# EAGLE schematic IR Sensor Schematic v17 (EAGLE 9.7.0)
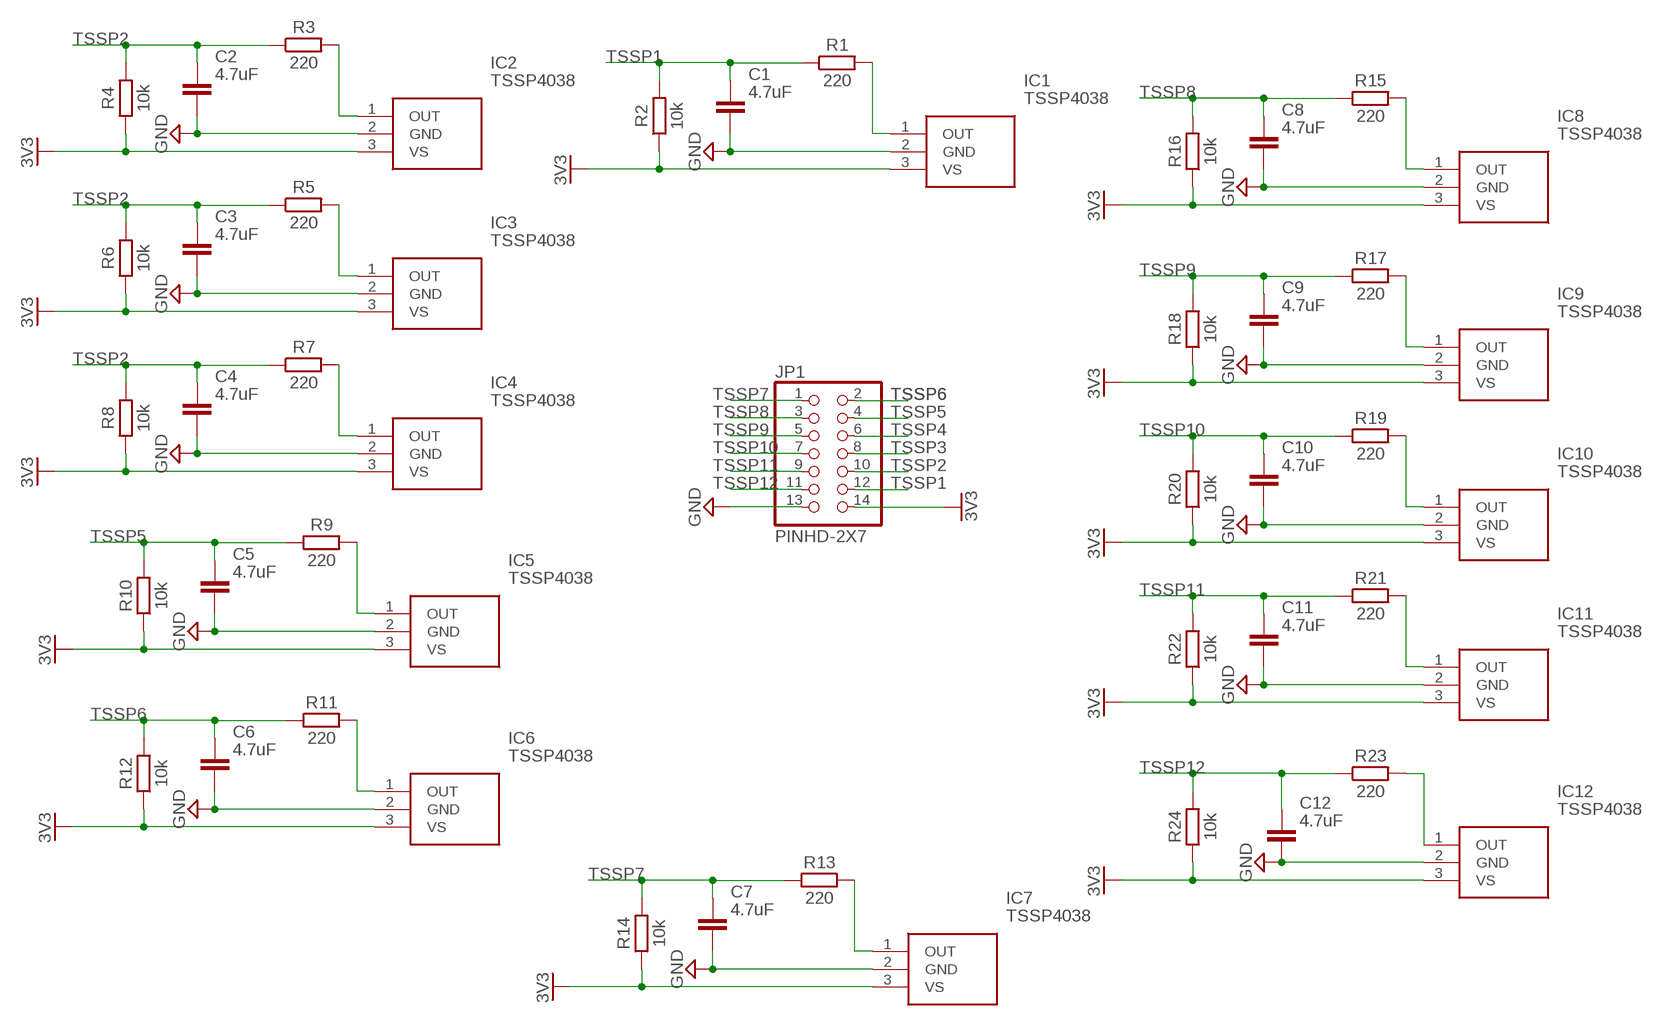
[diagram p0: schematic, sheet 1]

## Parts
C1  4.7uF  C_CHIP-1206(3216-METRIC)  [CAPC3216X135]
C2  4.7uF  C_CHIP-1206(3216-METRIC)  [CAPC3216X135]
C3  4.7uF  C_CHIP-1206(3216-METRIC)  [CAPC3216X135]
C4  4.7uF  C_CHIP-1206(3216-METRIC)  [CAPC3216X135]
C5  4.7uF  C_CHIP-1206(3216-METRIC)  [CAPC3216X135]
C6  4.7uF  C_CHIP-1206(3216-METRIC)  [CAPC3216X135]
C7  4.7uF  C_CHIP-1206(3216-METRIC)  [CAPC3216X135]
C8  4.7uF  C_CHIP-1206(3216-METRIC)  [CAPC3216X135]
C9  4.7uF  C_CHIP-1206(3216-METRIC)  [CAPC3216X135]
C10  4.7uF  C_CHIP-1206(3216-METRIC)  [CAPC3216X135]
C11  4.7uF  C_CHIP-1206(3216-METRIC)  [CAPC3216X135]
C12  4.7uF  C_CHIP-1206(3216-METRIC)  [CAPC3216X135]
IC1  TSSP4038  [TSSP4038]
IC2  TSSP4038  [TSSP4038]
IC3  TSSP4038  [TSSP4038]
IC4  TSSP4038  [TSSP4038]
IC5  TSSP4038  [TSSP4038]
IC6  TSSP4038  [TSSP4038]
IC7  TSSP4038  [TSSP4038]
IC8  TSSP4038  [TSSP4038]
IC9  TSSP4038  [TSSP4038]
IC10  TSSP4038  [TSSP4038]
IC11  TSSP4038  [TSSP4038]
IC12  TSSP4038  [TSSP4038]
JP1  PINHD-2X7  [2X07]
R1  220  R_CHIP-1206(3216-METRIC)  [RESC3216X70]
R2  10k  R_CHIP-1206(3216-METRIC)  [RESC3216X70]
R3  220  R_CHIP-1206(3216-METRIC)  [RESC3216X70]
R4  10k  R_CHIP-1206(3216-METRIC)  [RESC3216X70]
R5  220  R_CHIP-1206(3216-METRIC)  [RESC3216X70]
R6  10k  R_CHIP-1206(3216-METRIC)  [RESC3216X70]
R7  220  R_CHIP-1206(3216-METRIC)  [RESC3216X70]
R8  10k  R_CHIP-1206(3216-METRIC)  [RESC3216X70]
R9  220  R_CHIP-1206(3216-METRIC)  [RESC3216X70]
R10  10k  R_CHIP-1206(3216-METRIC)  [RESC3216X70]
R11  220  R_CHIP-1206(3216-METRIC)  [RESC3216X70]
R12  10k  R_CHIP-1206(3216-METRIC)  [RESC3216X70]
R13  220  R_CHIP-1206(3216-METRIC)  [RESC3216X70]
R14  10k  R_CHIP-1206(3216-METRIC)  [RESC3216X70]
R15  220  R_CHIP-1206(3216-METRIC)  [RESC3216X70]
R16  10k  R_CHIP-1206(3216-METRIC)  [RESC3216X70]
R17  220  R_CHIP-1206(3216-METRIC)  [RESC3216X70]
R18  10k  R_CHIP-1206(3216-METRIC)  [RESC3216X70]
R19  220  R_CHIP-1206(3216-METRIC)  [RESC3216X70]
R20  10k  R_CHIP-1206(3216-METRIC)  [RESC3216X70]
R21  220  R_CHIP-1206(3216-METRIC)  [RESC3216X70]
R22  10k  R_CHIP-1206(3216-METRIC)  [RESC3216X70]
R23  220  R_CHIP-1206(3216-METRIC)  [RESC3216X70]
R24  10k  R_CHIP-1206(3216-METRIC)  [RESC3216X70]

## Nets
3V3: IC1.3(VS) IC2.3(VS) IC3.3(VS) IC4.3(VS) IC5.3(VS) IC6.3(VS) IC7.3(VS) IC8.3(VS) IC9.3(VS) IC10.3(VS) IC11.3(VS) IC12.3(VS) JP1.14 R2.1 R4.1 R6.1 R8.1 R10.1 R12.1 R14.1 R16.1 R18.1 R20.1 R22.1 R24.1
GND: C1.2 C2.2 C3.2 C4.2 C5.2 C6.2 C7.2 C8.2 C9.2 C10.2 C11.2 C12.2 IC1.2(GND) IC2.2(GND) IC3.2(GND) IC4.2(GND) IC5.2(GND) IC6.2(GND) IC7.2(GND) IC8.2(GND) IC9.2(GND) IC10.2(GND) IC11.2(GND) IC12.2(GND) JP1.13
N$1: IC12.1(OUT) R23.2
N$2: IC1.1(OUT) R1.2
N$3: IC2.1(OUT) R3.2
N$5: IC3.1(OUT) R5.2
N$7: IC4.1(OUT) R7.2
N$9: IC5.1(OUT) R9.2
N$11: IC6.1(OUT) R11.2
N$13: IC7.1(OUT) R13.2
N$15: IC8.1(OUT) R15.2
N$17: IC9.1(OUT) R17.2
N$19: IC10.1(OUT) R19.2
N$21: IC11.1(OUT) R21.2
TSSP1: C1.1 JP1.12 R1.1 R2.2
TSSP2: C2.1 C3.1 C4.1 JP1.10 R3.1 R4.2 R5.1 R6.2 R7.1 R8.2
TSSP3: JP1.8
TSSP4: JP1.6
TSSP5: C5.1 JP1.4 R9.1 R10.2
TSSP6: C6.1 JP1.2 R11.1 R12.2
TSSP7: C7.1 JP1.1 R13.1 R14.2
TSSP8: C8.1 JP1.3 R15.1 R16.2
TSSP9: C9.1 JP1.5 R17.1 R18.2
TSSP10: C10.1 JP1.7 R19.1 R20.2
TSSP11: C11.1 JP1.9 R21.1 R22.2
TSSP12: C12.1 JP1.11 R23.1 R24.2

## Library data of the parts
C1-C12 = Tutorial - Fusion 360:C: Capacitor - Generic; CATEGORY: Capacitor
IC1-IC12 = TSSP4038:TSSP4038: IR Receiver Module 38KHz 25m EMI 3-Pin Vishay TSSP4038, 38kHz IR Receiver, 950nm +/-45 , 25m Range, 2.5V - 5V, Through Hole, 6 x 3.9 x 6.95mm Source: Datasheet <https://componentsearchengine.com/Datasheets/2/TSSP4038.pdf>; ARROW_PART_NUMBER: TSSP4038; ARROW_PRICE-STOCK: https://www.arrow.com/en/products/tssp4038/vishay?region=nac; DESCRIPTION: IR Receiver Module 38KHz 25m EMI 3-Pin Vishay TSSP4038, 38kHz IR Receiver, 950nm +/-45 , 25m Range, 2.5V - 5V, Through Hole, 6 x 3.9 x 6.95mm; HEIGHT: mm; MANUFACTURER_NAME: Vishay; MANUFACTURER_PART_NUMBER: TSSP4038; MOUSER_PART_NUMBER: 782-TSSP4038; MOUSER_PRICE-STOCK: https://www.mouser.co.uk/ProductDetail/Vishay-Semiconductors/TSSP4038?qs=lgjwDzixuo3Ja5hn%252BEmOdw%3D%3D
JP1 = Connector:PINHD-2X7: PIN HEADER; CATEGORY: Headers; DESCRIPTION: Header, Straight, 2x7 Position; MANUFACTURER: Generic; MPN: Generic; OPERATING_TEMPERATURE: Generic; PART_STATUS: Active; PITCH: 0.100" (2.54mm); ROHS_COMPLIANCE: Generic; SERIES: Generic; SUB-CATEGORY: Headers, Male Pins; TYPE: Board to Board or Cable, Unshrouded, Through Hole, Straight
R1-R24 = Resistor:R: Resistor Fixed - Generic; CATEGORY: Resistor; SUB-CATEGORY: Fixed